# EAGLE design buggym2017 (EAGLE 7.7.0)
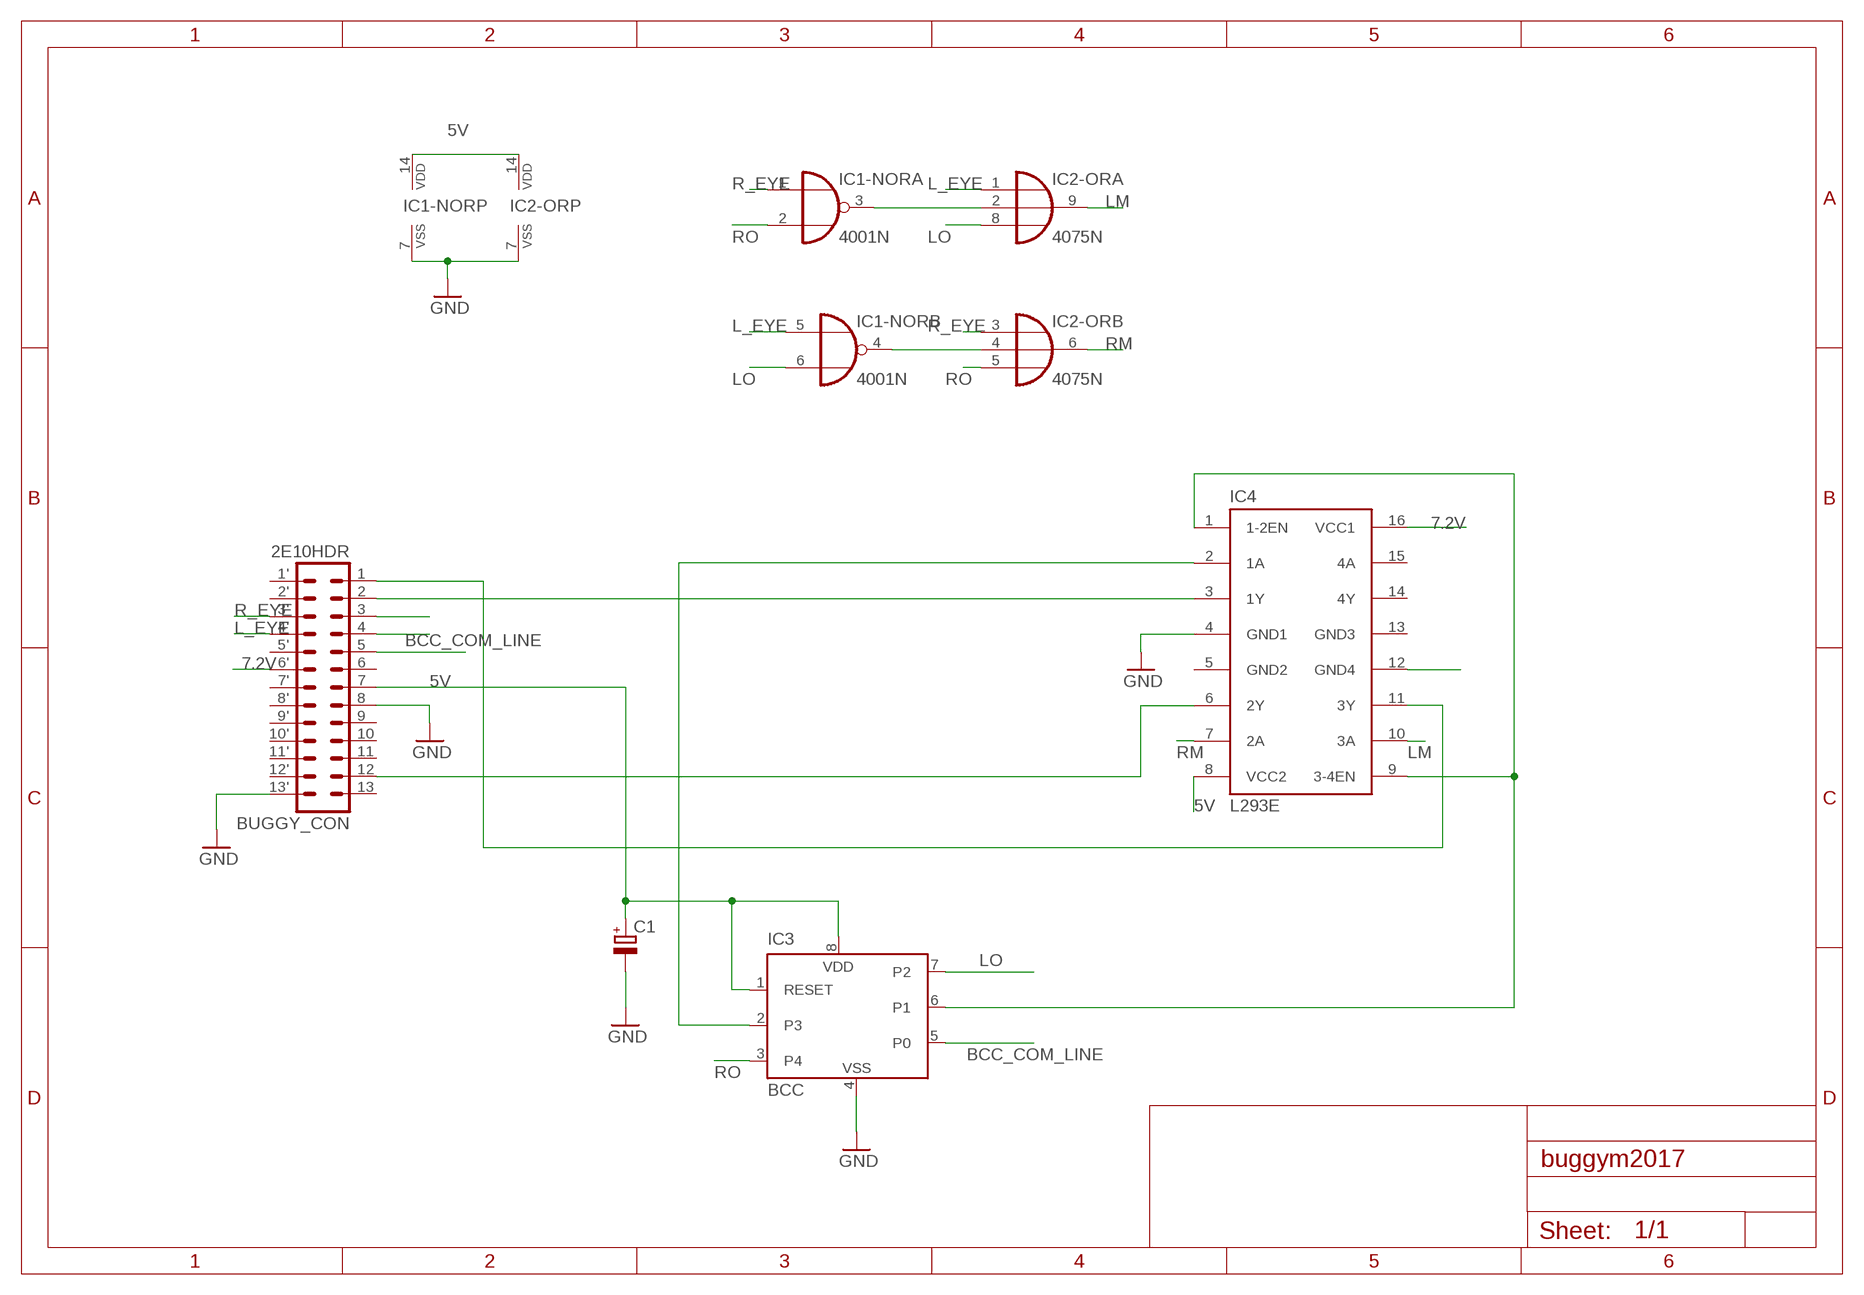
[diagram p0: schematic, sheet 1]

## Parts
BUGGY_CON  2E10HDR  [2E10BOARD]
C1  CPOL-EUE5-4  [E5-4]
IC1-NOR  4001N  [DIL14]
IC2-OR  4075N  [DIL14]
IC3  BCC  [DIL8]
IC4  L293E  [DIL16]

## Nets
5V: BUGGY_CON.7 C1.+ IC1-NOR.14(P:VDD) IC2-OR.14(P:VDD) IC3.1(RESET) IC3.8(5V) IC4.8(VCC2)
7.2V: BUGGY_CON.6' IC4.16(VCC1)
BCC_COM_LINE: BUGGY_CON.5 IC3.5(P0)
GND: BUGGY_CON.8 BUGGY_CON.13' C1.- IC1-NOR.7(P:VSS) IC2-OR.7(P:VSS) IC3.4(VSS) IC4.4(GND1)
L_EYE: BUGGY_CON.4 BUGGY_CON.4' IC1-NOR.5(B:I0) IC2-OR.1(A:I0)
LINK_1: IC1-NOR.3(A:O) IC2-OR.2(A:I1)
LINK_2: IC1-NOR.4(B:O) IC2-OR.4(B:I1)
LM: IC2-OR.9(A:O) IC4.10(3A)
LO: IC1-NOR.6(B:I1) IC2-OR.8(A:I2) IC3.7(P2)
N$2: IC3.2(P3) IC4.2(1A)
N$3: BUGGY_CON.1 IC4.11(3Y)
N$5: BUGGY_CON.12 IC4.6(2Y)
N$6: BUGGY_CON.2 IC4.3(1Y)
N$7: IC4.12(GND4)
N$9: IC3.6(P1) IC4.1(1-2EN) IC4.9(3-4EN)
R_EYE: BUGGY_CON.3 BUGGY_CON.3' IC1-NOR.1(A:I0) IC2-OR.3(B:I0)
RM: IC2-OR.6(B:O) IC4.7(2A)
RO: IC1-NOR.2(A:I1) IC2-OR.5(B:I2) IC3.3(P4)
Unconnected: BUGGY_CON.1' BUGGY_CON.2' BUGGY_CON.5' BUGGY_CON.6 BUGGY_CON.7' BUGGY_CON.8' BUGGY_CON.9 BUGGY_CON.9' BUGGY_CON.10 BUGGY_CON.10' BUGGY_CON.11 BUGGY_CON.11' BUGGY_CON.12' BUGGY_CON.13 IC1-NOR.8(C:I0) IC1-NOR.9(C:I1) IC1-NOR.10(C:O) IC1-NOR.11(D:O) IC1-NOR.12(D:I0) IC1-NOR.13(D:I1) IC2-OR.10(C:O) IC2-OR.11(C:I0) IC2-OR.12(C:I1) IC2-OR.13(C:I2) IC4.14(4Y) IC4.15(4A)

## Power pins joined to a net without a drawn wire
GND2: IC4.5(GND2)
GND3: IC4.13(GND3)

## Library data of the parts
BUGGY_CON = 2E10:2E10HDR
C1 = rcl:CPOL-EU: POLARIZED CAPACITOR, European symbol
IC1-NOR = 40xx:4001: Quad 2-input NOR
IC2-OR = 40xx:4075: Triple 3-input OR
IC3 = shane1:BCC
IC4 = texas:L293E: TI DEVICE; MF: Arrow Electronics; MPN: L293E; OC_FARNELL: 1467711; OC_NEWARK: 89K0732

## Board
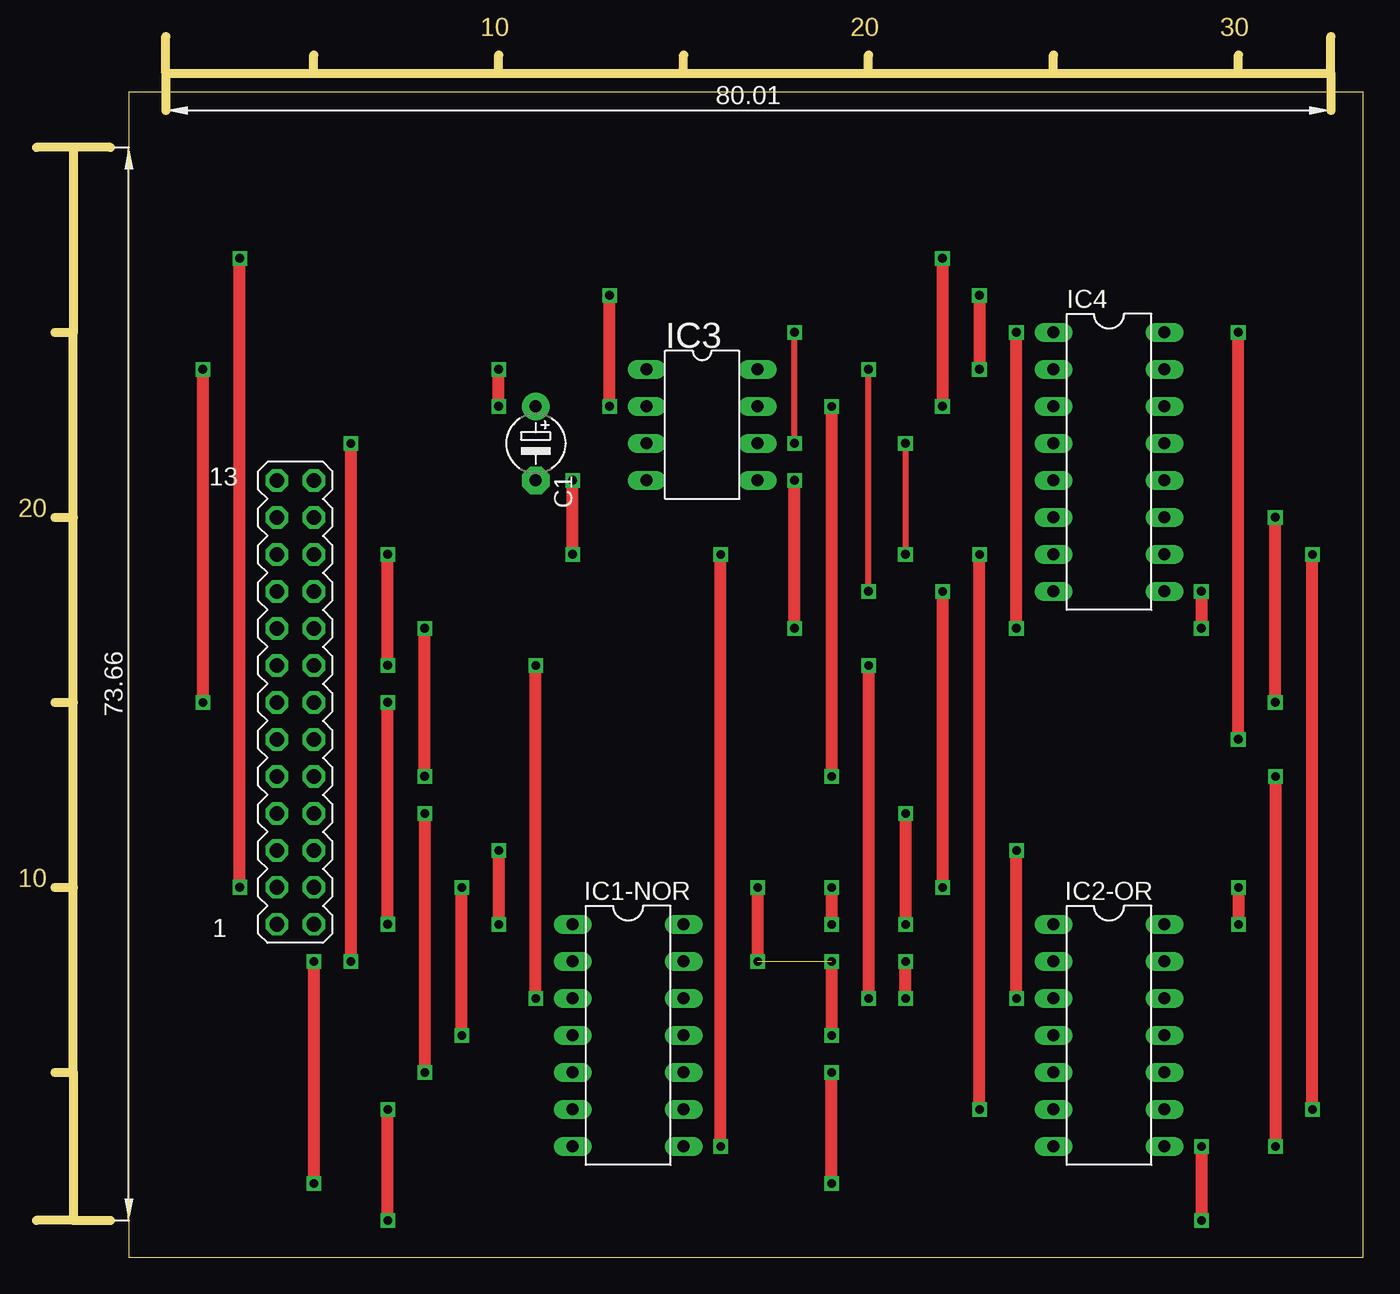
[diagram p1: board, top side]
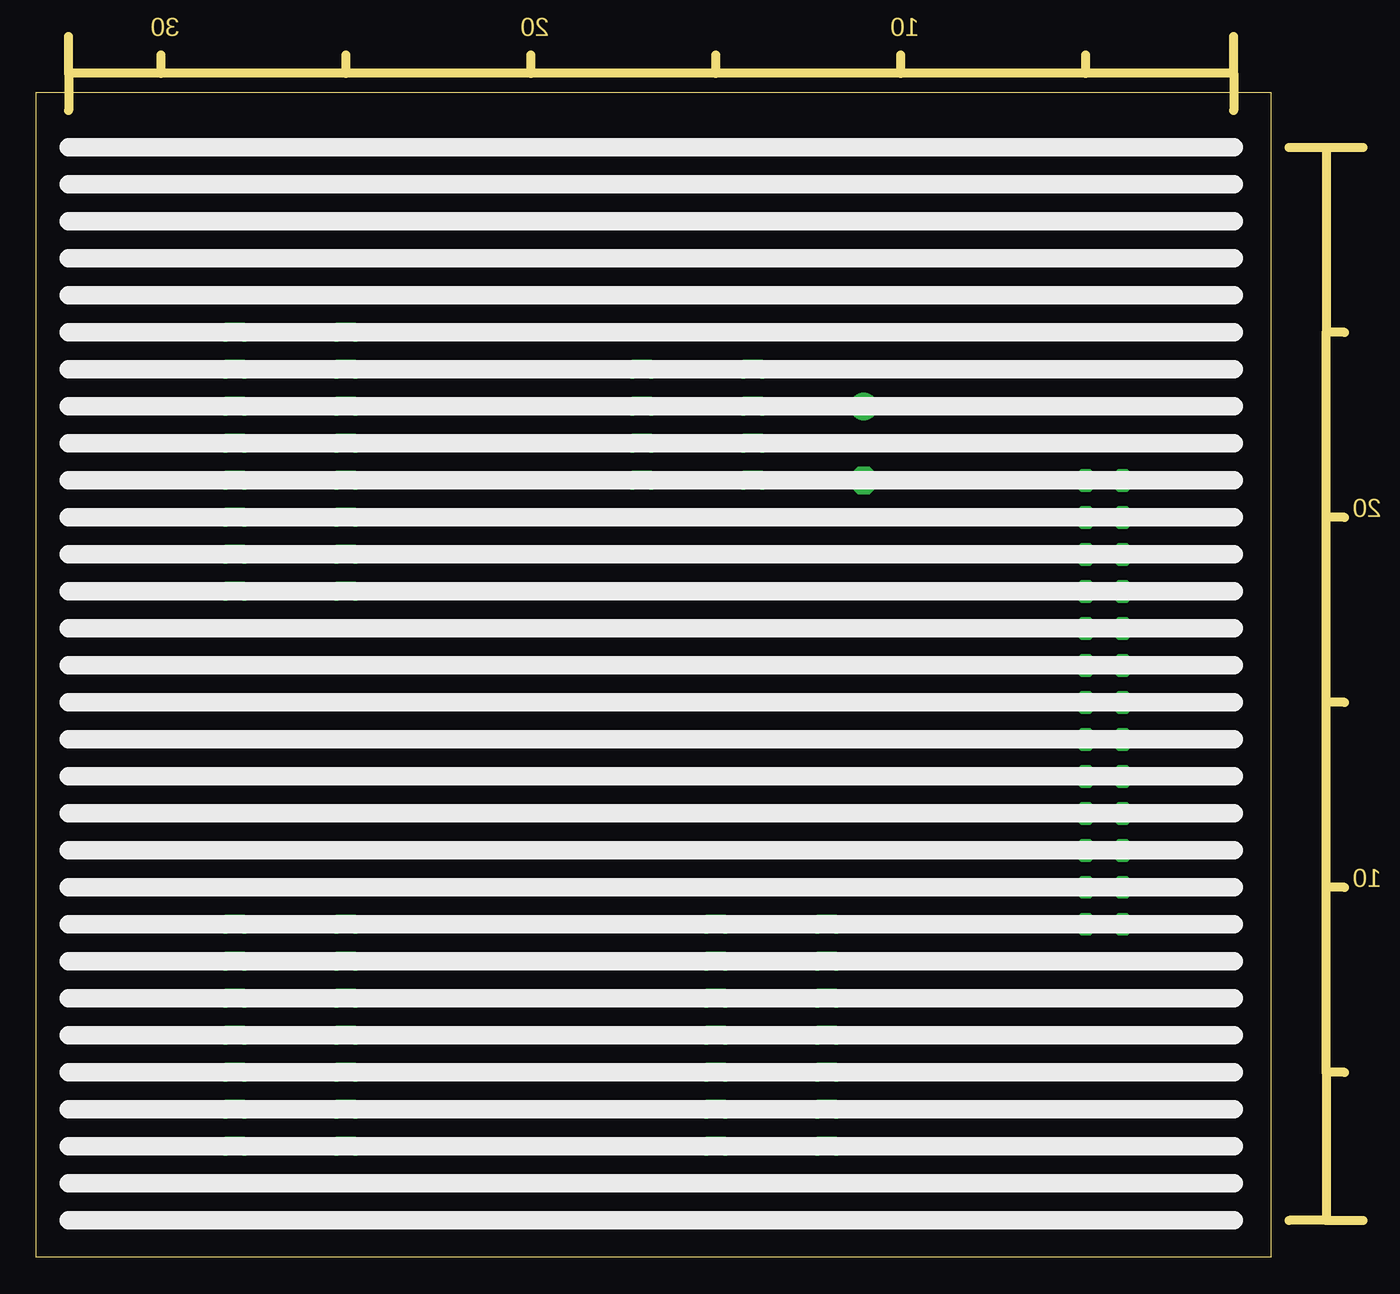
[diagram p2: board, bottom side, seen from below]

Size 84.76 x 80 mm. Coordinates in mm from the lower left corner, seen from the top.
Outline: 0,0 84.76,0 84.76,80 0,80 0,0
Copper layers (1*16): Top 0.035mm / dielectric 1.5mm / Bottom 0.035mm
Design rules "default *": minimum track width 32mil, minimum drill 24mil, track to track 8mil, track to pad 8mil, pad to pad 8mil, via to via 8mil, smd to smd 8mil, copper to edge 40mil, drill to drill 8mil, minimum pad ring 10mil, minimum via ring 8mil, stop-mask expansion 4mil, vias tented up to drill 0mil, thermal gap 10mil

### Footprints (pad centres in the part's own frame; a part is rotated, then mirrored left to right if it is on the bottom)
2E10BOARD = drill 1.016 octagon: 1 1.27,-15.24; 1' -1.27,-15.24; 2 1.27,-12.7; 2' -1.27,-12.7; 3 1.27,-10.16; 3' -1.27,-10.16; 4 1.27,-7.62; 4' -1.27,-7.62; 5 1.27,-5.08; 5' -1.27,-5.08; 6 1.27,-2.54; 6' -1.27,-2.54; 7 1.27,0; 7' -1.27,0; 8 1.27,2.54; 8' -1.27,2.54; 9 1.27,5.08; 9' -1.27,5.08; 10 1.27,7.62; 10' -1.27,7.62; 11 1.27,10.16; 11' -1.27,10.16; 12 1.27,12.7; 12' -1.27,12.7; 13 1.27,15.24; 13' -1.27,15.24
E5-4 = drill 0.813 pad 1.905: + -2.54,0 | drill 0.813 pad 1.905 octagon: - 2.54,0
DIL14 = drill 0.813 long: 1 -7.62,-3.81; 2 -5.08,-3.81; 3 -2.54,-3.81; 4 0,-3.81; 5 2.54,-3.81; 6 5.08,-3.81; 7 7.62,-3.81; 8 7.62,3.81; 9 5.08,3.81; 10 2.54,3.81; 11 0,3.81; 12 -2.54,3.81; 13 -5.08,3.81; 14 -7.62,3.81
DIL8 = drill 0.813 long: 1 -3.81,-3.81; 2 -1.27,-3.81; 3 1.27,-3.81; 4 3.81,-3.81; 5 3.81,3.81; 6 1.27,3.81; 7 -1.27,3.81; 8 -3.81,3.81
DIL16 = drill 0.813 long: 1 -8.89,-3.81; 2 -6.35,-3.81; 3 -3.81,-3.81; 4 -1.27,-3.81; 5 1.27,-3.81; 6 3.81,-3.81; 7 6.35,-3.81; 8 8.89,-3.81; 9 8.89,3.81; 10 6.35,3.81; 11 3.81,3.81; 12 1.27,3.81; 13 -1.27,3.81; 14 -3.81,3.81; 15 -6.35,3.81; 16 -8.89,3.81

### Placement (x,y rotation side)
BUGGY_CON  11.43,38.1 0 top
C1  27.94,55.88 270 top
IC1-NOR  34.29,15.24 270 top
IC2-OR  67.31,15.24 270 top
IC3  39.37,57.15 270 top
IC4  67.31,54.61 270 top

### Tracks (layer width: path | path; a pad name or v marks a point on that pad's centre or on a via)
5V  (via drill 0.6, 0.61)
  Top 0.406: v50.8,45.72 v50.8,60.96
  Top 0.813: v5.08,60.96 v5.08,38.1 | v25.4,58.42 v25.4,60.96 | v55.88,45.72 v55.88,25.4 | v48.26,25.4 v48.26,22.86 | v76.2,25.4 v76.2,22.86
  Bottom 0.813: v5.08,60.96 v25.4,60.96 IC3.1 IC3.8 v50.8,60.96 | v5.08,38.1 BUGGY_CON.7 | C1.+ v25.4,58.42 | IC4.8 v55.88,45.72 v50.8,45.72 | v48.26,25.4 v55.88,25.4 v76.2,25.4 | v48.26,22.86 IC1-NOR.14 | v76.2,22.86 IC2-OR.14
  other vias: 38.1,22.86 71.12,22.86
7.2V  (via drill 0.61)
  Top 0.813: v76.2,35.56 v76.2,63.5
  Bottom 0.813: 12.7,35.56 v76.2,35.56 | v76.2,63.5 IC4.16
BCC_COM_LINE  (via drill 0.61)
  Top 0.813: v20.32,33.02 v20.32,43.18 | v45.72,43.18 v45.72,53.34
  Bottom 0.813: BUGGY_CON.5 v20.32,33.02 | v20.32,43.18 v45.72,43.18 | v45.72,53.34 IC3.5
GND  (via drill 0.6, 0.61)
  Top 0.406: v53.34,55.88 v53.34,48.26
  Top 0.813: v30.48,48.26 v30.48,53.34 | v17.78,40.64 v17.78,48.26 | v40.64,7.62 v40.64,48.26
  Bottom 0.813: IC3.4 v30.48,53.34 C1.- 12.7,53.34 | IC4.4 v53.34,55.88 | v53.34,48.26 v40.64,48.26 v30.48,48.26 v17.78,48.26 | BUGGY_CON.8 v17.78,40.64 | IC1-NOR.7 v40.64,7.62 IC2-OR.7
L_EYE  (via drill 0.6)
  Top 0.813: v20.32,30.48 v20.32,12.7 | v53.34,30.48 v53.34,22.86
  Bottom 0.813: BUGGY_CON.4 v20.32,30.48 v53.34,30.48 | v20.32,12.7 IC1-NOR.5 | v53.34,22.86 IC2-OR.1
LINK_1  (via drill 0.6)
  Top 0.813: v53.34,17.78 v53.34,20.32 | v27.94,17.78 v27.94,40.64 | v50.8,40.64 v50.8,17.78
  Bottom 0.813: v53.34,20.32 IC2-OR.2 | IC1-NOR.3 v27.94,17.78 | v27.94,40.64 v50.8,40.64 | v50.8,17.78 v53.34,17.78
LINK_2  (via drill 0.6)  (1 unrouted)
  Top 0.813: v22.86,15.24 v22.86,25.4 | v43.18,25.4 v43.18,20.32 | v48.26,20.32 v48.26,15.24
  Bottom 0.813: IC1-NOR.4 v22.86,15.24 | v22.86,25.4 v43.18,25.4 | v43.18,20.32 v48.26,20.32 | v48.26,15.24 IC2-OR.4
LM  (via drill 0.6)
  Top 0.813: v81.28,10.16 v81.28,48.26
  Bottom 0.813: IC2-OR.9 v81.28,10.16 | v81.28,48.26 IC4.10
LO  (via drill 0.6)
  Top 0.813: v48.26,58.42 v48.26,33.02 | v78.74,33.02 v78.74,7.62 | v73.66,7.62 v73.66,2.54 | v17.78,2.54 v17.78,10.16
  Bottom 0.813: IC3.7 v48.26,58.42 | v48.26,33.02 v78.74,33.02 | v78.74,7.62 v73.66,7.62 IC2-OR.8 | v73.66,2.54 v17.78,2.54 | v17.78,10.16 IC1-NOR.6
N$1  (via drill 0.6)
  other vias: 48.26,15.24
N$2  (via drill 0.61)
  Top 0.813: v33.02,58.42 v33.02,66.04 | v58.42,66.04 v58.42,60.96
  Bottom 0.813: IC3.2 v33.02,58.42 | v33.02,66.04 v58.42,66.04 | v58.42,60.96 IC4.2
N$3  (via drill 0.61)
  Top 0.813: v17.78,22.86 v17.78,38.1 | v78.74,38.1 v78.74,50.8
  Bottom 0.813: BUGGY_CON.1 v17.78,22.86 | v17.78,38.1 v78.74,38.1 | v78.74,50.8 IC4.11
N$5
  Bottom 0.813: BUGGY_CON.12 IC4.6
N$6  (via drill 0.61)
  Top 0.813: v7.62,25.4 v7.62,68.58 | v55.88,68.58 v55.88,58.42
  Bottom 0.813: BUGGY_CON.2 v7.62,25.4 | v7.62,68.58 v55.88,68.58 | v55.88,58.42 IC4.3
N$9  (via drill 0.61)
  Top 0.406: v45.72,55.88 v45.72,63.5
  Top 0.813: v73.66,45.72 v73.66,43.18 | v60.96,43.18 v60.96,63.5
  Bottom 0.813: IC3.6 v45.72,55.88 | v45.72,63.5 v60.96,63.5 IC4.1 | IC4.9 v73.66,45.72 | v73.66,43.18 v60.96,43.18
R_EYE  (via drill 0.6)
  Top 0.813: v25.4,27.94 v25.4,22.86 | v60.96,17.78 v60.96,27.94
  Bottom 0.813: BUGGY_CON.3 v25.4,27.94 v60.96,27.94 | v25.4,22.86 IC1-NOR.1 | IC2-OR.3 v60.96,17.78
RM  (via drill 0.6)
  Top 0.813: v58.42,10.16 v58.42,48.26
  Bottom 0.813: IC2-OR.6 v58.42,10.16 | v58.42,48.26 IC4.7
RO  (via drill 0.6)
  Top 0.813: v15.24,55.88 v15.24,20.32 | v48.26,5.08 v48.26,12.7 | v12.7,20.32 v12.7,5.08
  Bottom 0.813: IC3.3 v15.24,55.88 | IC1-NOR.2 v15.24,20.32 v12.7,20.32 | v48.26,12.7 IC2-OR.5 | v12.7,5.08 v48.26,5.08

### Text on the board
Unrouted: X | X | X | X | X | X | X | X | X | X | X | X | X | X | X | X | X | X | X | X | X | X | X | X | X | X | X | X | X | X | X | X | X | X | X | X | X | X | X | X | X | X | X | X | X | X | X | X